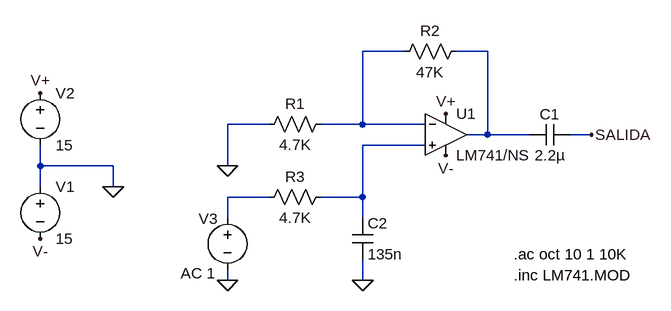
[diagram p0: schematic lm741-filtro-paso-bajo.asc]
lm741-filtro-paso-bajo.asc, the LTspice schematic file:
Version 4
SHEET 1 908 680
WIRE 352 48 288 48
WIRE 480 48 432 48
WIRE 144 160 80 160
WIRE 288 160 288 48
WIRE 288 160 224 160
WIRE 384 160 288 160
WIRE 480 176 480 48
WIRE 480 176 448 176
WIRE 544 176 480 176
WIRE 640 176 608 176
WIRE 384 192 288 192
WIRE -208 224 -208 192
WIRE -96 224 -208 224
WIRE 80 224 80 160
WIRE -208 256 -208 224
WIRE -96 256 -96 224
WIRE 144 272 80 272
WIRE 288 272 288 192
WIRE 288 272 224 272
WIRE 80 304 80 272
WIRE 288 304 288 272
WIRE 80 400 80 384
WIRE 288 400 288 368
FLAG -96 256 0
FLAG 640 176 SALIDA
FLAG -208 112 V+
FLAG 416 144 V+
FLAG -208 336 V-
FLAG 416 208 V-
FLAG 80 400 0
FLAG 288 400 0
FLAG 80 224 0
SYMBOL Opamps\\opamp2 416 112 R0
SYMATTR InstName U1
SYMATTR Value LM741/NS
SYMBOL voltage -208 240 R0
WINDOW 123 0 0 Left 0
WINDOW 39 0 0 Left 0
SYMATTR InstName V1
SYMATTR Value 15
SYMBOL voltage -208 96 R0
WINDOW 123 0 0 Left 0
WINDOW 39 0 0 Left 0
SYMATTR InstName V2
SYMATTR Value 15
SYMBOL res 448 32 R90
WINDOW 0 0 56 VBottom 2
WINDOW 3 32 56 VTop 2
SYMATTR InstName R2
SYMATTR Value 47K
SYMBOL res 240 144 R90
WINDOW 0 0 56 VBottom 2
WINDOW 3 32 56 VTop 2
SYMATTR InstName R1
SYMATTR Value 4.7K
SYMBOL cap 608 160 R90
WINDOW 0 0 32 VBottom 2
WINDOW 3 32 32 VTop 2
SYMATTR InstName C1
SYMATTR Value 2.2µ
SYMBOL voltage 80 288 R0
WINDOW 123 -72 101 Left 2
WINDOW 39 0 0 Left 0
WINDOW 0 -44 17 Left 2
WINDOW 3 -175 94 Left 2
SYMATTR Value2 AC 1
SYMATTR InstName V3
SYMATTR Value ""
SYMBOL res 240 256 R90
WINDOW 0 0 56 VBottom 2
WINDOW 3 32 56 VTop 2
SYMATTR InstName R3
SYMATTR Value 4.7K
SYMBOL cap 272 304 R0
SYMATTR InstName C2
SYMATTR Value 135n
TEXT 520 360 Left 2 !.ac oct 10 1 10K
TEXT 520 392 Left 2 !.inc LM741.MOD

The netlist it stands for:
* lm741-filtro-paso-bajo.asc
XU1 N003 N001 V+ V- N002 LM741/NS  ; pins In+ In- V+ V- OUT
V1 0 V- 15
V2 V+ 0 15
R2 N002 N001 47K
R1 N001 0 4.7K
C1 SALIDA N002 2.2µ
V3 N004 0 AC 1
R3 N003 N004 4.7K
C2 N003 0 135n
.ac oct 10 1 10K
.inc LM741.MOD
.backanno
.end